# EAGLE schematic ninja star (EAGLE 9.5.2)
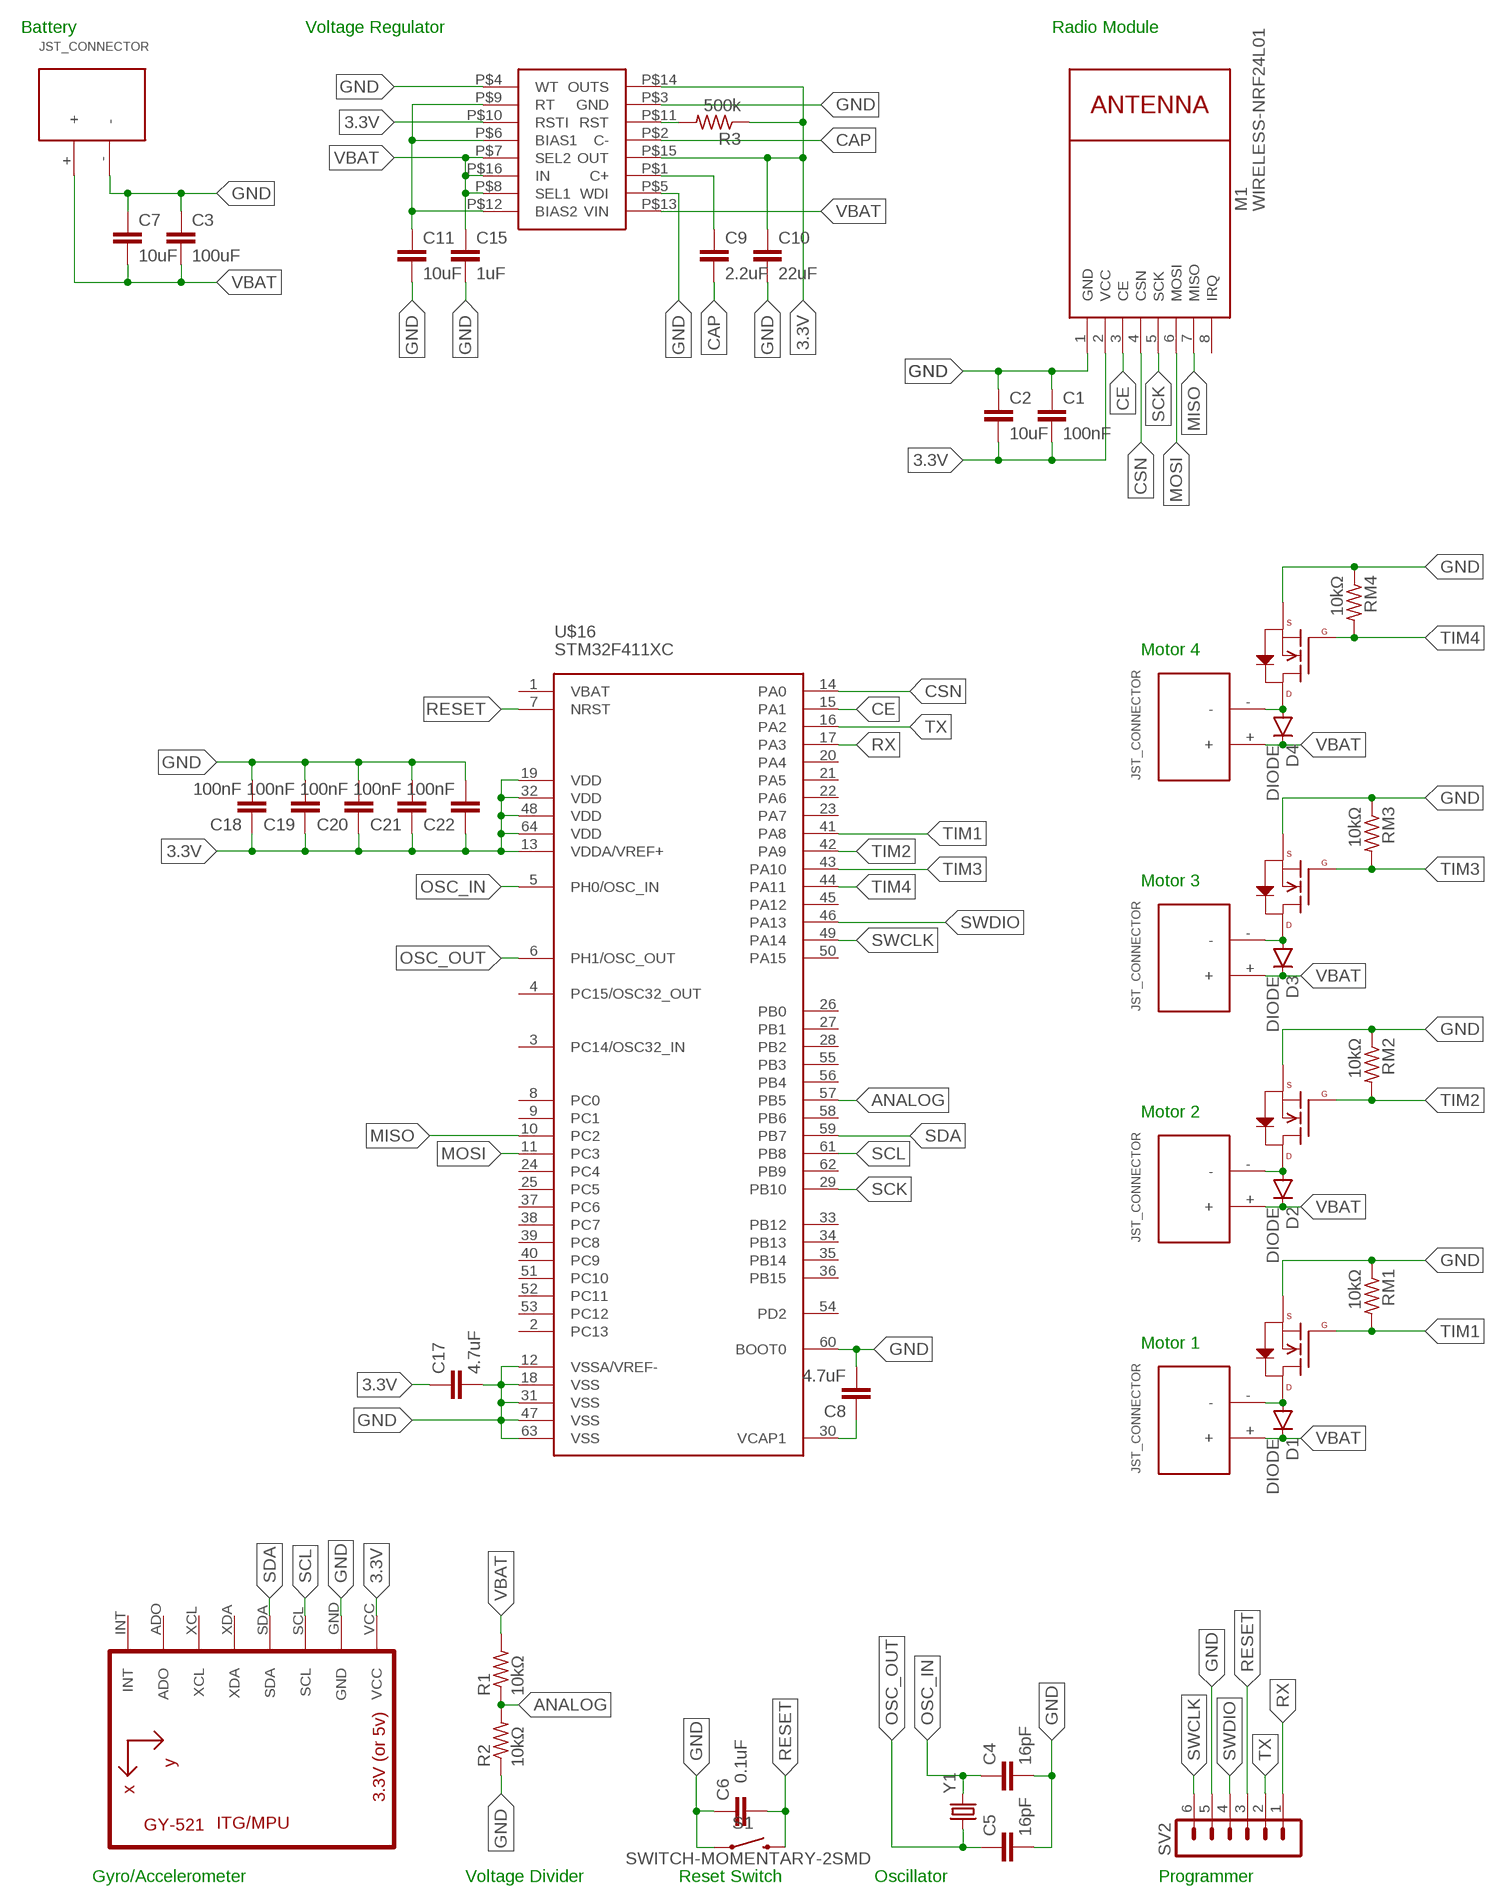
[diagram p0: schematic, sheet 1]

## Parts
C1  100nF  C-EUC0603  [C0603]
C2  10uF  C-EUC0603  [C0603]
C3  100uF  C-EUC1206  [C1206]
C4  16pF  C-EUC0603  [C0603]
C5  16pF  C-EUC0603  [C0603]
C6  0.1uF  C-EUC0603  [C0603]
C7  10uF  C-EUC0603  [C0603]
C8  4.7uF  C-EUC0603  [C0603]
C9  2.2uF  C-EUC0603  [C0603]
C10  22uF  C-EUC0603  [C0603]
C11  10uF  C-EUC0603  [C0603]
C15  1uF  C-EUC0603  [C0603]
C17  4.7uF  C-EUC0603  [C0603]
C18  100nF  C-EUC0603  [C0603]
C19  100nF  C-EUC0603  [C0603]
C20  100nF  C-EUC0603  [C0603]
C21  100nF  C-EUC0603  [C0603]
C22  100nF  C-EUC0603  [C0603]
D1  DIODE  [C0603]
D2  DIODE  [C0603]
D3  DIODE  [C0603]
D4  DIODE  [C0603]
M1  WIRELESS-NRF24L01  [WIRELESS-NRF24L01]
MOS1  N-CHANNEL-MOSFET-IRLML6244TRPBF  [SOT23-3]
MOS2  N-CHANNEL-MOSFET-IRLML6244TRPBF  [SOT23-3]
MOS3  N-CHANNEL-MOSFET-IRLML6244TRPBF  [SOT23-3]
MOS4  N-CHANNEL-MOSFET-IRLML6244TRPBF  [SOT23-3]
MOTOR1  JST_CONNECTOR_FEMALE  [JST_CONNECTOR_FEMALE]
MOTOR2  JST_CONNECTOR_FEMALE  [JST_CONNECTOR_FEMALE]
MOTOR3  JST_CONNECTOR_FEMALE  [JST_CONNECTOR_FEMALE]
MOTOR4  JST_CONNECTOR_FEMALE  [JST_CONNECTOR_FEMALE]
R1  10kΩ  R-US_R0603  [R0603]
R2  10kΩ  R-US_R0603  [R0603]
R3  500k  R-0603  [R0603]
RM1  10kΩ  R-0603  [R0603]
RM2  10kΩ  R-0603  [R0603]
RM3  10kΩ  R-0603  [R0603]
RM4  10kΩ  R-0603  [R0603]
S1  SWITCH-MOMENTARY-2SMD  [TACTILE-SWITCH-SMD]
SV2  MA06-1  [MA06-1]
U1  GY-521MPU6050  [GY-521]
U$7  JST_CONNECTOR_FEMALE  [JST_CONNECTOR_FEMALE]
U$12  VR-LTC3246  [MSOP-16]
U$16  STM32F411XC  [LQFP64]
Y1  CRYSTALHC49US  [HC49US]

## Nets
3.3V: C1.2 C2.2 C10.1 C17.1 C18.1 C19.1 C20.1 C21.1 C22.1 M1.2(VCC) R3.1 U1.VCC U$12.P$10(RSTI) U$12.P$14(OUTS) U$12.P$15(OUT) U$16.13(VDDA/VREF+) U$16.19(VDD) U$16.32(VDD) U$16.48(VDD) U$16.64(VDD)
ANALOG: R1.1 R2.2 U$16.57(PB5)
CAP: C9.2 U$12.P$2(C-)
CE: M1.3(CE) U$16.15(PA1)
CSN: M1.4(CSN) U$16.14(PA0)
GND: C1.1 C2.1 C3.1 C4.2 C5.2 C6.1 C7.1 C8.2 C10.2 C11.2 C15.2 C17.2 C18.2 C19.2 C20.2 C21.2 C22.2 M1.1(GND) MOS1.2(S) MOS2.2(S) MOS3.2(S) MOS4.2(S) R2.1 RM1.1 RM2.1 RM3.1 RM4.1 S1.1 SV2.5 U1.GND U$7.- U$12.P$3(GND) U$12.P$4(WT) U$12.P$5(WDI) U$16.12(VSSA/VREF-) U$16.18(VSS) U$16.31(VSS) U$16.47(VSS) U$16.60(BOOT0) U$16.63(VSS)
MISO: M1.7(MISO) U$16.10(PC2)
MOSI: M1.6(MOSI) U$16.11(PC3)
N$1: C9.1 U$12.P$1(C+)
N$2: D2.2(PPIN) MOS2.3(D) MOTOR2.-
N$3: D1.2(PPIN) MOS1.3(D) MOTOR1.-
N$4: D3.2(PPIN) MOS3.3(D) MOTOR3.-
N$5: D4.2(PPIN) MOS4.3(D) MOTOR4.-
N$6: R3.2 U$12.P$11(RST)
N$7: C8.1 U$16.30(VCAP1)
N$11: C11.1 U$12.P$6(BIAS1) U$12.P$9(RT) U$12.P$12(BIAS2)
OSC_IN: C4.1 U$16.5(PH0/OSC_IN) Y1.2
OSC_OUT: C5.1 U$16.6(PH1/OSC_OUT) Y1.1
RESET: C6.2 S1.3 SV2.3 U$16.7(NRST)
RX: SV2.1 U$16.17(PA3)
SCK: M1.5(SCK) U$16.29(PB10)
SCL: U1.SCL U$16.61(PB8)
SDA: U1.SDA U$16.59(PB7)
SWCLK: SV2.6 U$16.49(PA14)
SWDIO: SV2.4 U$16.46(PA13)
TIM1: MOS1.1(G) RM1.2 U$16.41(PA8)
TIM2: MOS2.1(G) RM2.2 U$16.42(PA9)
TIM3: MOS3.1(G) RM3.2 U$16.43(PA10)
TIM4: MOS4.1(G) RM4.2 U$16.44(PA11)
TX: SV2.2 U$16.16(PA2)
VBAT: C3.2 C7.2 C15.1 D1.1(GPIN) D2.1(GPIN) D3.1(GPIN) D4.1(GPIN) MOTOR1.+ MOTOR2.+ MOTOR3.+ MOTOR4.+ R1.2 U$7.+ U$12.P$7(SEL2) U$12.P$8(SEL1) U$12.P$13(VIN) U$12.P$16(IN)
Unconnected: M1.8(IRQ) U1.ADO U1.INT U1.XCL U1.XDA U$16.1(VBAT) U$16.2(PC13) U$16.3(PC14/OSC32_IN) U$16.4(PC15/OSC32_OUT) U$16.8(PC0) U$16.9(PC1) U$16.20(PA4) U$16.21(PA5) U$16.22(PA6) U$16.23(PA7) U$16.24(PC4) U$16.25(PC5) U$16.26(PB0) U$16.27(PB1) U$16.28(PB2) U$16.33(PB12) U$16.34(PB13) U$16.35(PB14) U$16.36(PB15) U$16.37(PC6) U$16.38(PC7) U$16.39(PC8) U$16.40(PC9) U$16.45(PA12) U$16.50(PA15) U$16.51(PC10) U$16.52(PC11) U$16.53(PC12) U$16.54(PD2) U$16.55(PB3) U$16.56(PB4) U$16.58(PB6) U$16.62(PB9)

## Notes on the sheet
- Battery | Voltage Regulator | Radio Module
- Motor 4
- Motor 3
- Motor 2
- Motor 1
- Gyro/Accelerometer | Voltage Divider | Reset Switch | Oscillator | Programmer

## Library data of the parts
C1-C11 C15 C17-C22 = rcl:C-EU: CAPACITOR, European symbol; SPICEPREFIX: C
D1-D4 = AP_quad_updated:DIODE: Diode of the motors.
M1 = Aircopter_quad_lib:WIRELESS-NRF24L01: 2.4 GHz Wireless Module based on NRF24L01 chip
MOS1-MOS4 = Aircopter_quad_lib:N-CHANNEL-MOSFET: N-Channel MOSFET Mode Field Effect Transistor; DATASHEET: http://www.mouser.com/ds/2/196/irlml6244pbf-936666.pdf; MOUSER: 942-IRLML6244TRPBF; URL: http://www.mouser.com/Search/ProductDetail.aspx?R=IRLML6244TRPBFvirtualkey57370000virtualkey942-IRLML6244TRPBF
MOTOR1-MOTOR4 U$7 = Aircopter_quad_lib:JST_CONNECTOR_FEMALE
R1 R2 = rcl:R-US_: RESISTOR, American symbol; SPICEPREFIX: R
R3 = AP_quad:R-0603: Resistor with 0603 package.
RM1-RM4 = AP_quad_updated:R-0603: Resistor with 0603 package.
S1 = Aircopter_quad_lib:SWITCH-MOMENTARY-2: Various NO switches- pushbuttons, reed, etc; PROD_ID: SWCH-08247
SV2 = con-lstb:MA06-1: PIN HEADER; OC_FARNELL: unknown; OC_NEWARK: unknown
U1 = Aircopter_quad_lib:GY-521
U$12 = AP_quad_updated:VR-LTC3246: Regulates voltage.
U$16 = Aircopter_quad_lib (1):STM32F411XC: STM32F411XC
Y1 = AP_quad_updated:CRYSTAL: Crystals Various standard crystals. Proven footprints. Spark Fun Electronics SKU : COM-00534